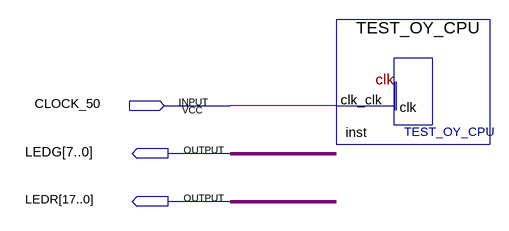
[diagram p0: schematic sheet]
// Quartus schematic TEST_OY_CPU_SYSTEM.bdf as structural Verilog: 1 symbols, 3 pins
module TEST_OY_CPU_SYSTEM (
  input  CLOCK_50,
  output [7:0] LEDG,
  output [17:0] LEDR
);

  TEST_OY_CPU inst (.clk_clk(CLOCK_50));
endmodule
